# EAGLE board interfacez_main_r2_5 (EAGLE 6.4), part 1 of 2
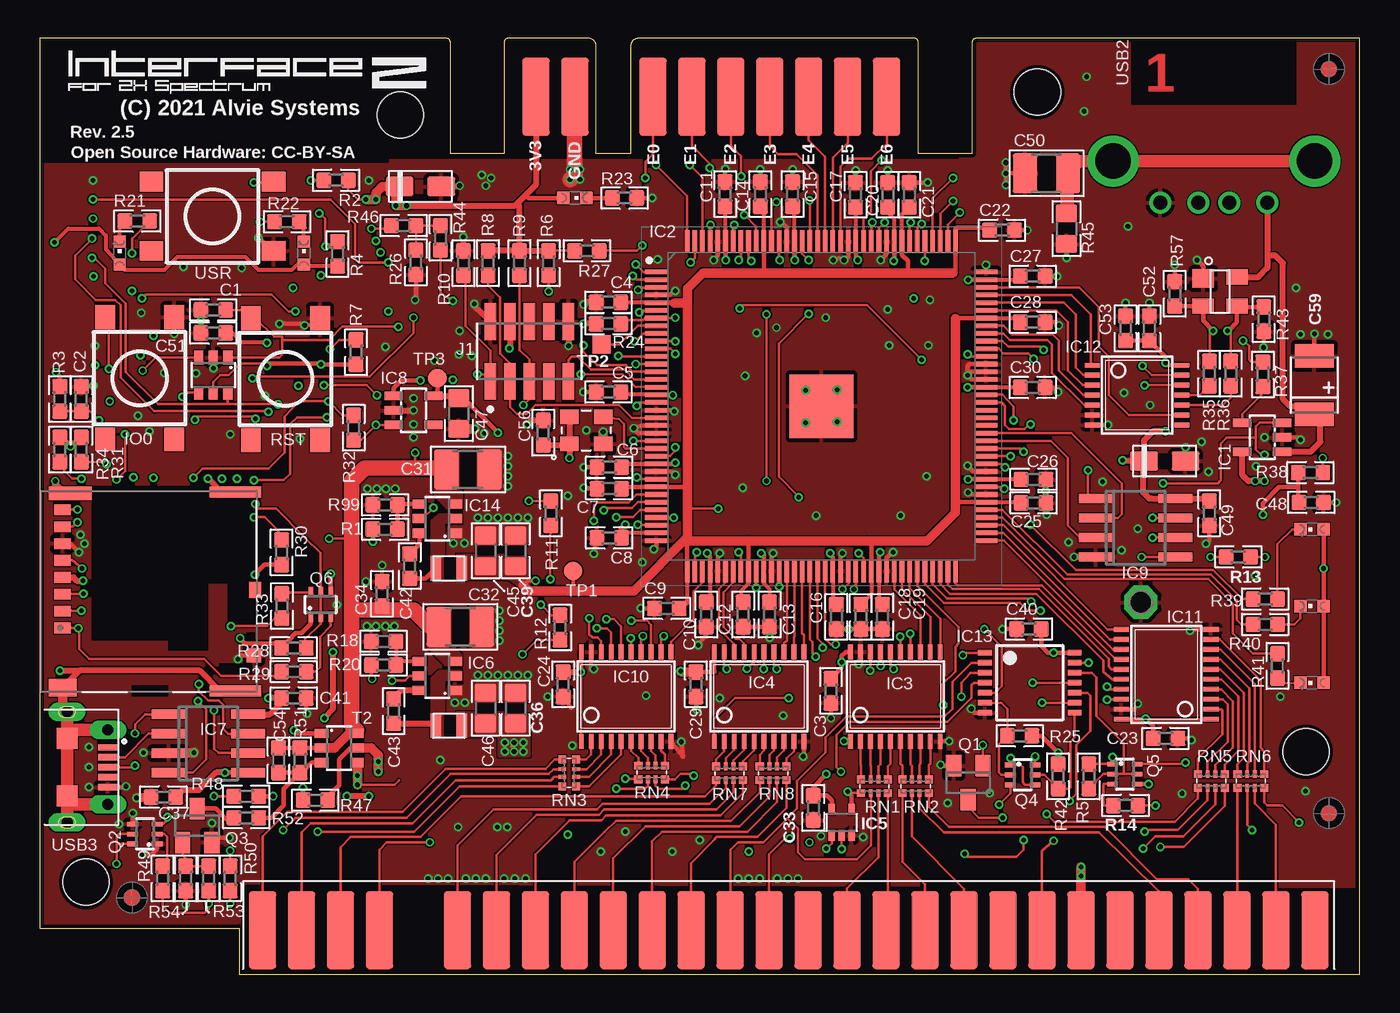
[diagram p5: board, top side]
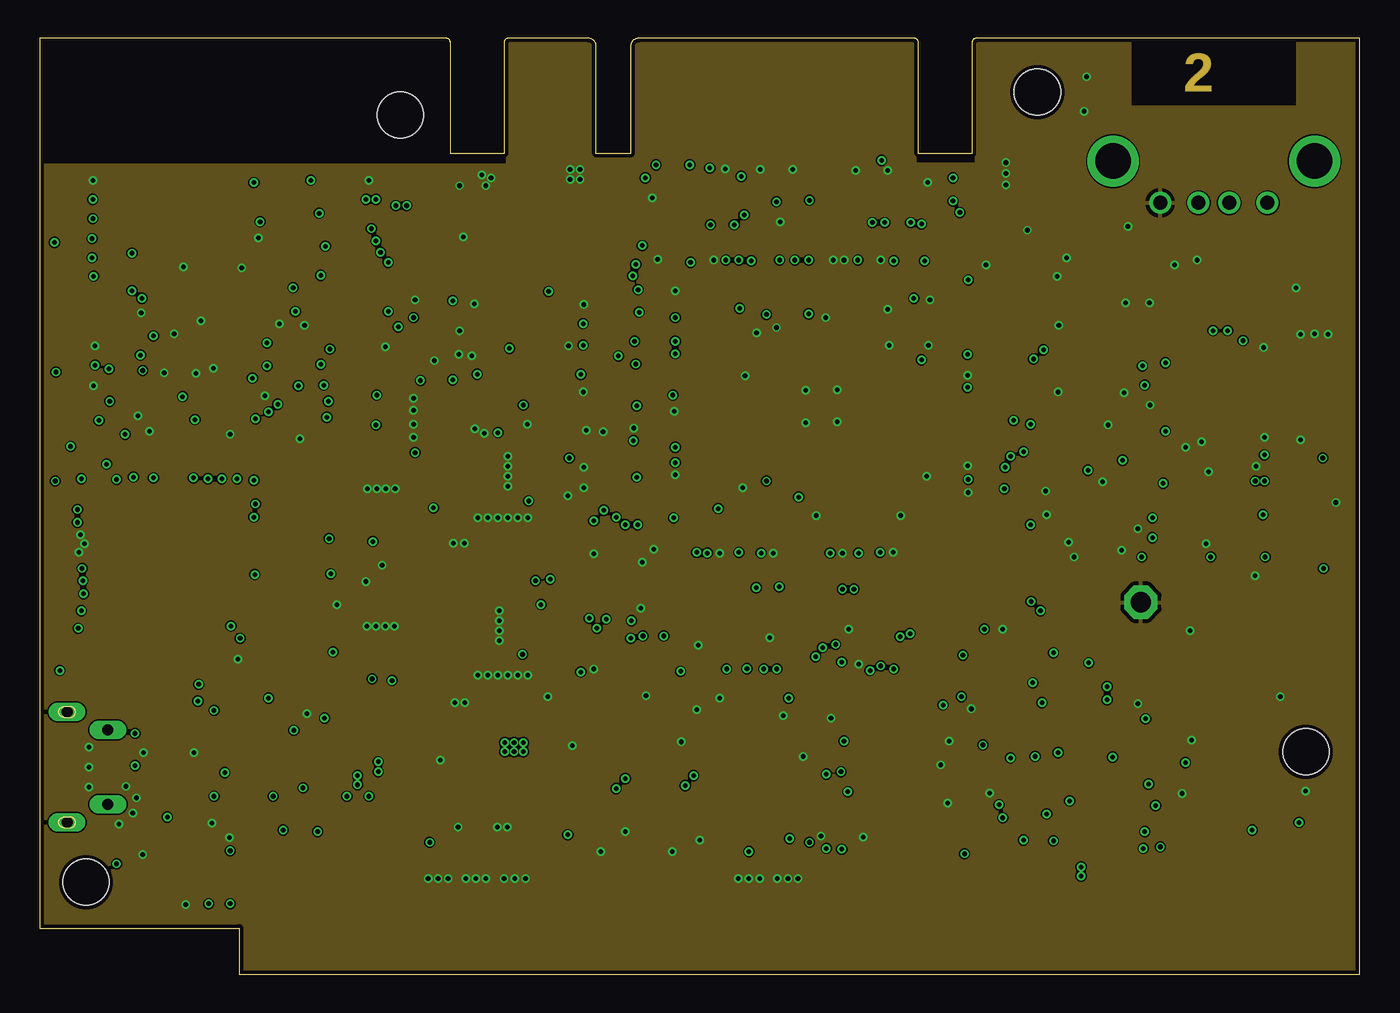
[diagram p6: board, inner layer GND]
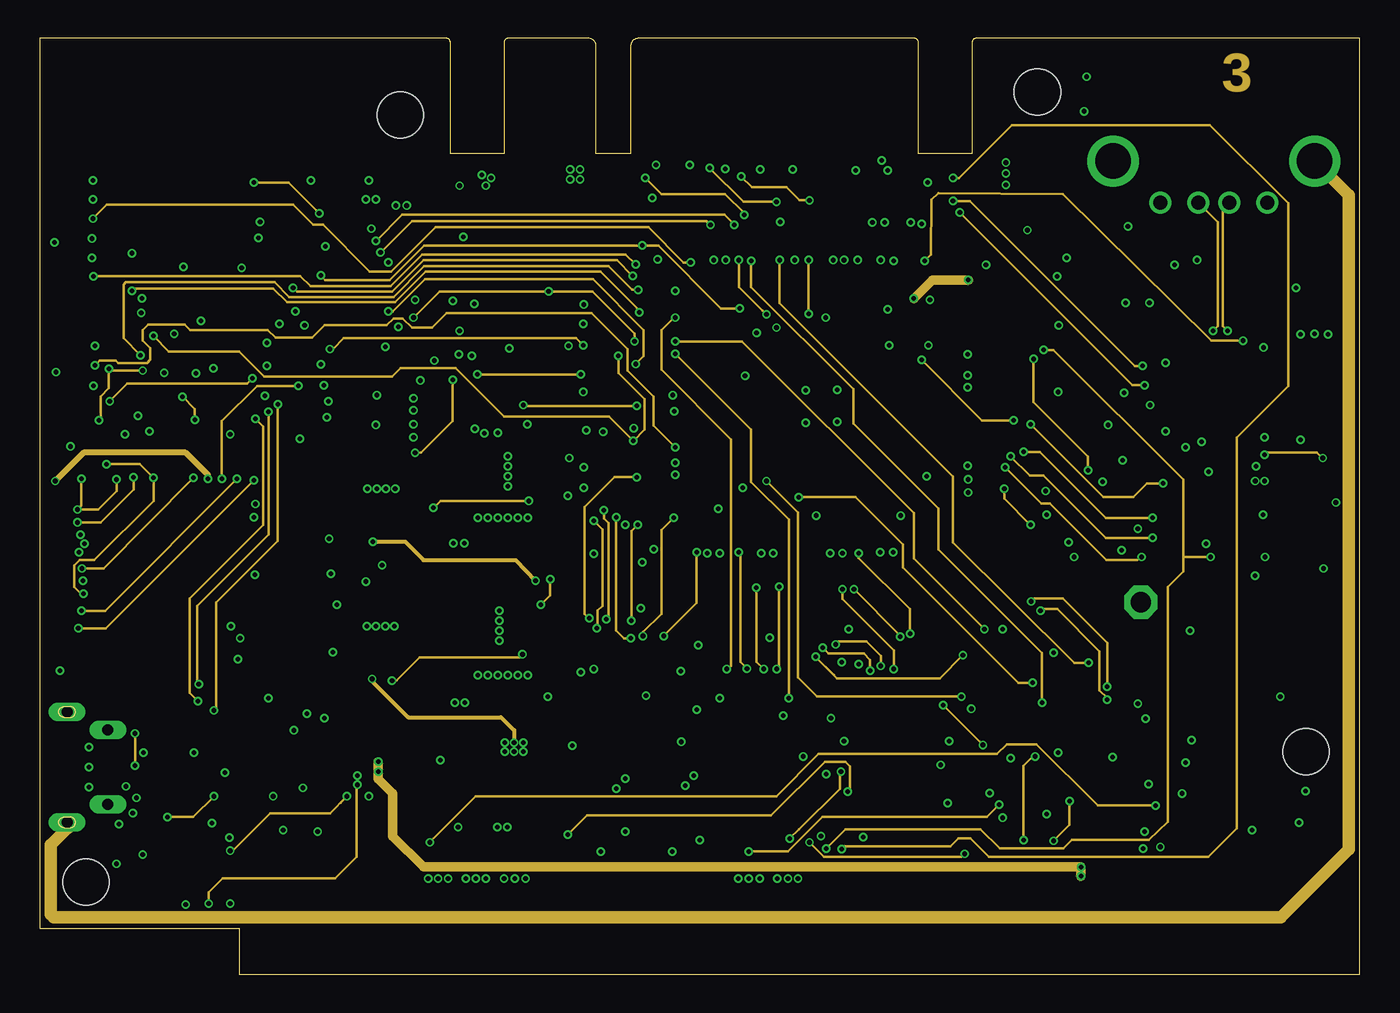
[diagram p7: board, inner layer Route]
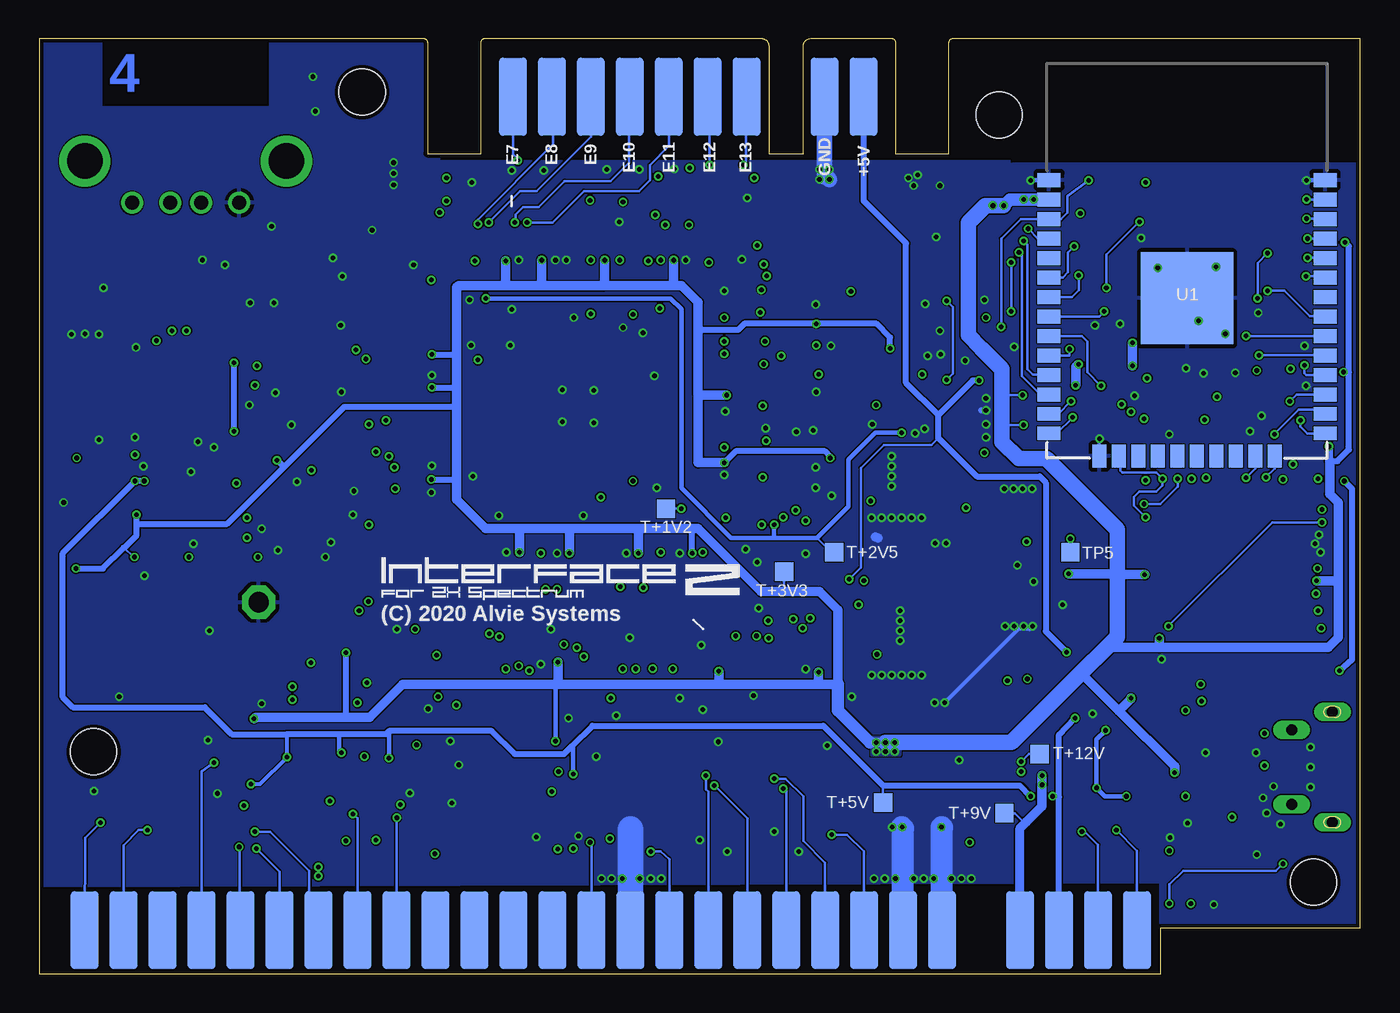
[diagram p8: board, bottom side, seen from below]

Size 86 x 61 mm. Coordinates in mm from the lower left corner, seen from the top.
Outline: 0,61 0,3 13,3 13,0 86,0 86,61 61,61 arc90 60.75,60.75 60.75,53.5 57.25,53.5 57.25,60.75 arc90 57,61 39,61 arc90 38.5,60.5 38.5,53.5 36.25,53.5 36.25,60.5 arc90 35.75,61 30.5,61 arc90 30.25,60.75 30.25,53.5 26.75,53.5 26.75,60.75 arc90 26.5,61 0,61
Copper layers (1*2*15*16): Top 0.035mm / dielectric 0.18mm / GND 0.017mm / dielectric 1.12mm / Route 0.017mm / dielectric 0.18mm / PWR 0.035mm
Design rules "JLCPCB-FourLayerLayer *": minimum track width 3.5mil, minimum drill 0.3mm, track to track 3.5mil, track to pad 5mil, pad to pad 5mil, via to via 5mil, smd to smd 0mil, copper to edge 10mil, drill to drill 10mil, minimum pad ring 10mil, minimum via ring 0.125mm, stop-mask expansion 2mil, vias tented up to drill 100mil, thermal gap 10mil
Holes 3 mm at 3,6 82.5,14.5 23.5,56 65,57.5

## Footprints (pad centres in the part's own frame; a part is rotated, then mirrored left to right if it is on the bottom)
0603 = smd 1 x 1: 1 -0.8,0; 2 0.8,0
1210 = smd 1.6 x 2.6: 1 -1.4,0; 2 1.4,0
0805 = smd 1.2 x 1.4: 1 -1,0; 2 1,0
TANT_CASE_A = smd 1.8 x 1.23: MINUS 1.355,0; PLUS -1.355,0
TE-B-3528 = smd 1.524 x 2.54: + 1.905,0; - -1.905,0
ZX-EDGE-DAUGHTERBOARD = smd 1.778 x 5.08 bottom: A1 6.35,-1.27; A2 3.81,-1.27; A3 1.27,-1.27; A4 -1.27,-1.27; A6 -6.35,-1.27; A7 -8.89,-1.27; A8 -11.43,-1.27; A9 -13.97,-1.27; A10 -16.51,-1.27; A11 -19.05,-1.27; A12 -21.59,-1.27; A13 -24.13,-1.27; A14 -26.67,-1.27; A15 -29.21,-1.27; A16 -31.75,-1.27; A17 -34.29,-1.27; A18 -36.83,-1.27; A19 -39.37,-1.27; A20 -41.91,-1.27; A21 -44.45,-1.27; A22 -46.99,-1.27; A23 -49.53,-1.27; A24 -52.07,-1.27; A25 -54.61,-1.27; A26 -57.15,-1.27; A27 -59.69,-1.27; A28 -62.23,-1.27 | smd 1.778 x 5.08: B1 6.35,-1.27; B2 3.81,-1.27; B3 1.27,-1.27; B4 -1.27,-1.27; B6 -6.35,-1.27; B7 -8.89,-1.27; B8 -11.43,-1.27; B9 -13.97,-1.27; B10 -16.51,-1.27; B11 -19.05,-1.27; B12 -21.59,-1.27; B13 -24.13,-1.27; B14 -26.67,-1.27; B15 -29.21,-1.27; B16 -31.75,-1.27; B17 -34.29,-1.27; B18 -36.83,-1.27; B19 -39.37,-1.27; B20 -41.91,-1.27; B21 -44.45,-1.27; B22 -46.99,-1.27; B23 -49.53,-1.27; B24 -52.07,-1.27; B25 -54.61,-1.27; B26 -57.15,-1.27; B27 -59.69,-1.27; B28 -62.23,-1.27
SOT23-5L = smd 0.55 x 1.2: 1 -0.95,-1.3; 2 0,-1.3; 3 0.95,-1.3; 4 0.95,1.3; 5 -0.95,1.3
QFP50P2200X2200X165-145N = smd 1.475 x 0.3: 1 -10.738,8.75; 2 -10.738,8.25; 3 -10.738,7.75; 4 -10.738,7.25; 5 -10.738,6.75; 6 -10.738,6.25; 7 -10.738,5.75; 8 -10.738,5.25; 9 -10.738,4.75; 10 -10.738,4.25; 11 -10.738,3.75; 12 -10.738,3.25; 13 -10.738,2.75; 14 -10.738,2.25; 15 -10.738,1.75; 16 -10.738,1.25; 17 -10.738,0.75; 18 -10.738,0.25; 19 -10.738,-0.25; 20 -10.738,-0.75; 21 -10.738,-1.25; 22 -10.738,-1.75; 23 -10.738,-2.25; 24 -10.738,-2.75; 25 -10.738,-3.25; 26 -10.738,-3.75; 27 -10.738,-4.25; 28 -10.738,-4.75; 29 -10.738,-5.25; 30 -10.738,-5.75; 31 -10.738,-6.25; 32 -10.738,-6.75; 33 -10.738,-7.25; 34 -10.738,-7.75; 35 -10.738,-8.25; 36 -10.738,-8.75; 73 10.738,-8.75; 74 10.738,-8.25; 75 10.738,-7.75; 76 10.738,-7.25; 77 10.738,-6.75; 78 10.738,-6.25; 79 10.738,-5.75; 80 10.738,-5.25; 81 10.738,-4.75; 82 10.738,-4.25; 83 10.738,-3.75; 84 10.738,-3.25; 85 10.738,-2.75; 86 10.738,-2.25; 87 10.738,-1.75; 88 10.738,-1.25; 89 10.738,-0.75; 90 10.738,-0.25; 91 10.738,0.25; 92 10.738,0.75; 93 10.738,1.25; 94 10.738,1.75; 95 10.738,2.25; 96 10.738,2.75; 97 10.738,3.25; 98 10.738,3.75; 99 10.738,4.25; 100 10.738,4.75; 101 10.738,5.25; 102 10.738,5.75; 103 10.738,6.25; 104 10.738,6.75; 105 10.738,7.25; 106 10.738,7.75; 107 10.738,8.25; 108 10.738,8.75 | smd 0.3 x 1.475: 37 -8.75,-10.738; 38 -8.25,-10.738; 39 -7.75,-10.738; 40 -7.25,-10.738; 41 -6.75,-10.738; 42 -6.25,-10.738; 43 -5.75,-10.738; 44 -5.25,-10.738; 45 -4.75,-10.738; 46 -4.25,-10.738; 47 -3.75,-10.738; 48 -3.25,-10.738; 49 -2.75,-10.738; 50 -2.25,-10.738; 51 -1.75,-10.738; 52 -1.25,-10.738; 53 -0.75,-10.738; 54 -0.25,-10.738; 55 0.25,-10.738; 56 0.75,-10.738; 57 1.25,-10.738; 58 1.75,-10.738; 59 2.25,-10.738; 60 2.75,-10.738; 61 3.25,-10.738; 62 3.75,-10.738; 63 4.25,-10.738; 64 4.75,-10.738; 65 5.25,-10.738; 66 5.75,-10.738; 67 6.25,-10.738; 68 6.75,-10.738; 69 7.25,-10.738; 70 7.75,-10.738; 71 8.25,-10.738; 72 8.75,-10.738; 109 8.75,10.738; 110 8.25,10.738; 111 7.75,10.738; 112 7.25,10.738; 113 6.75,10.738; 114 6.25,10.738; 115 5.75,10.738; 116 5.25,10.738; 117 4.75,10.738; 118 4.25,10.738; 119 3.75,10.738; 120 3.25,10.738; 121 2.75,10.738; 122 2.25,10.738; 123 1.75,10.738; 124 1.25,10.738; 125 0.75,10.738; 126 0.25,10.738; 127 -0.25,10.738; 128 -0.75,10.738; 129 -1.25,10.738; 130 -1.75,10.738; 131 -2.25,10.738; 132 -2.75,10.738; 133 -3.25,10.738; 134 -3.75,10.738; 135 -4.25,10.738; 136 -4.75,10.738; 137 -5.25,10.738; 138 -5.75,10.738; 139 -6.25,10.738; 140 -6.75,10.738; 141 -7.25,10.738; 142 -7.75,10.738; 143 -8.25,10.738; 144 -8.75,10.738 | smd 4.15 x 4.15: 145 0,0
TSSOP20 = smd 0.305 x 0.991: 1 -2.925,-2.918; 2 -2.275,-2.918; 3 -1.625,-2.918; 4 -0.975,-2.918; 5 -0.325,-2.918; 6 0.325,-2.918; 7 0.975,-2.918; 8 1.625,-2.918; 9 2.275,-2.918; 10 2.925,-2.918; 11 2.925,2.918; 12 2.275,2.918; 13 1.625,2.918; 14 0.975,2.918; 15 0.325,2.918; 16 -0.325,2.918; 17 -0.975,2.918; 18 -1.625,2.918; 19 -2.275,2.918; 20 -2.925,2.918
SC70-5 = smd 0.4 x 0.7: 1 -0.65,-0.85; 2 0,-0.85; 3 0.65,-0.85; 4 0.65,0.85; 5 -0.65,0.85
SOT23-6 = smd 0.6 x 0.9: 1 -0.95,-1.15; 2 0,-1.15; 3 0.95,-1.15; 4 0.95,1.15; 5 0,1.15; 6 -0.95,1.15
SOIC8 = smd 0.6 x 2.2: 1 -1.905,-2.6; 2 -0.635,-2.6; 3 0.635,-2.6; 4 1.905,-2.6; 5 1.905,2.6; 6 0.635,2.6; 7 -0.635,2.6; 8 -1.905,2.6
TSSOP14 = smd 0.305 x 0.991: 1 -1.95,-2.918; 2 -1.3,-2.918; 3 -0.65,-2.918; 4 0,-2.918; 5 0.65,-2.918; 6 1.3,-2.918; 7 1.95,-2.918; 8 1.95,2.918; 9 1.3,2.918; 10 0.65,2.918; 11 0,2.918; 12 -0.65,2.918; 13 -1.3,2.918; 14 -1.95,2.918
TSSOP14' = smd 0.35 x 0.9: 1 -1.95,-2.925; 2 -1.3,-2.925; 3 -0.65,-2.925; 4 0,-2.925; 5 0.65,-2.925; 6 1.3,-2.925; 7 1.95,-2.925; 8 1.95,2.925; 9 1.3,2.925; 10 0.65,2.925; 11 0,2.925; 12 -0.65,2.925; 13 -1.3,2.925; 14 -1.95,2.925
AMPHENOL_ICC_-_FCI_20021121-00010C4LF_0 = smd 0.76 x 2.4: 1 -2.54,-1.95; 2 -2.54,1.95; 3 -1.27,-1.95; 4 -1.27,1.95; 5 0,-1.95; 6 0,1.95; 7 1.27,-1.95; 8 1.27,1.95; 9 2.54,-1.95; 10 2.54,1.95
MOLEX_503398-1892 = smd 0.7 x 1.1: 1 -2.38,5.625; 2 -1.28,5.625; 3 -0.18,5.625; 4 0.92,5.625; 5 2.02,5.625; 6 3.12,5.625; 7 4.22,5.625; 8 5.32,5.625 | smd 0.9 x 0.93: 9 -4.17,-6.84 | smd 1.05 x 0.78: 10 0.095,-6.915 | smd 1.14 x 1.83: P1 -6.26,5.61 | smd 0.86 x 2.8: P2 6.4,5.125 | smd 0.7 x 3.33: P3 -6.48,-5.64; P4 6.48,-5.64
IND_0806 = smd 0.7 x 1.6: P$1 -0.85,0; P$2 0.85,0
LED-603 = smd 0.8 x 0.8: A 0,-0.75; C 0,0.75
SOT23 = smd 1 x 1.4: 1 -0.95,-1.1; 2 0.95,-1.1; 3 0,1.1
SOT363_INFINEON = smd 0.3 x 0.7: 1 -0.65,-0.8; 2 0,-0.8; 3 0.65,-0.8; 4 0.65,0.8; 5 0,0.8; 6 -0.65,0.8
EXB28V = smd 0.525 x 0.5: 1 -0.875,-0.45; 4 0.875,-0.45; 5 0.875,0.45; 8 -0.875,0.45 | smd 0.25 x 0.5: 2 -0.25,-0.45; 3 0.25,-0.45; 6 0.25,0.45; 7 -0.25,0.45
TACTILE_SWITCH_TALL = smd 1.55 x 1.3: A1 -3.975,-2.25; A2 3.975,-2.25; B1 -3.975,2.25; B2 3.975,2.25
TP12SQ = smd 1.2 x 1.2: TP 0,0
TP12R = smd 1.2 x 1.2: TP 0,0
P1-13 = drill 1.321 pad 2.159 octagon: TP 0,0
SP0503 = smd 1.2 x 1.4: 1 -0.85,-1.1 | smd 1 x 1.4: 2 0.95,-1.1; 3 0.95,1.1; 4 -0.95,1.1
ESP-WROOM-32 = smd 0.9 x 1.5: 1 7.7,9; 2 6.43,9; 3 5.16,9; 4 3.89,9; 5 2.62,9; 6 1.35,9; 7 0.08,9; 8 -1.19,9; 9 -2.46,9; 10 -3.73,9; 11 -5,9; 12 -6.27,9; 13 -7.54,9; 14 -8.81,9; 25 -8.81,-9; 26 -7.54,-9; 27 -6.27,-9; 28 -5,-9; 29 -3.73,-9; 30 -2.46,-9; 31 -1.19,-9; 32 0.08,-9; 33 1.35,-9; 34 2.62,-9; 35 3.89,-9; 36 5.16,-9; 37 6.43,-9; 38 7.7,-9 | smd 1.5 x 0.9: 15 -10.3,5.715; 16 -10.3,4.445; 17 -10.3,3.175; 18 -10.3,1.905; 19 -10.3,0.635; 20 -10.3,-0.635; 21 -10.3,-1.905; 22 -10.3,-3.175; 23 -10.3,-4.445; 24 -10.3,-5.715 | smd 6 x 6: GND 0,0
KC3225K = smd 1.2 x 0.95: 1 -1.1,-0.875; 2 1.1,-0.875; 3 1.1,0.875; 4 -1.1,0.875
INTERFACEZ_EXPANSION_DAUGHTERCARD = smd 1.778 x 5.08 bottom: A1 11.43,0; A2 8.89,0; A4 3.81,0; A5 1.27,0; A6 -1.27,0; A7 -3.81,0; A8 -6.35,0; A9 -8.89,0; A10 -11.43,0 | smd 1.778 x 5.08: B1 11.43,0; B2 8.89,0; B4 3.81,0; B5 1.27,0; B6 -1.27,0; B7 -3.81,0; B8 -6.35,0; B9 -8.89,0; B10 -11.43,0
USB-A-H = drill 0.914: D+ 2.718,-1.003; D- 2.718,1.003; GND 2.718,-3.493; VBUS 2.718,3.493 | drill 2.311: P$5 0,-6.566; P$6 0,6.566
MICROUSB_SMD_TH_7.5MM_4.85MM = smd 0.4 x 1.25: P1 1.3,-2.815; P2 0.65,-2.815; P3 0,-2.815; P4 -0.65,-2.815; P5 -1.3,-2.815 | smd 1.375 x 1.375: S1 -1.875,-0.175; S2 1.875,-0.175 | drill 0.7 pad 1.05 long: S3 -3.6,-0.175; S4 3.6,-0.175 | drill 0.7 pad 1 long: S5 -2.425,-2.825; S6 2.425,-2.825

## Placement (x,y rotation side)
C1  100nF 6.3V  [0603]  11.3,43.3 0 top
C2  100nF 6.3V  [0603]  2.7,37.5 270 top
C3  100nF 6.3V  [0603]  51.55,18.48 270 top
C4  100nF 6.3V  [0603]  37.05,43.8 180 top
C5  100nF 6.3V  [0603]  37.05,37.95 180 top
C6  100nF 6.3V  [0603]  37.1,33.05 180 top
C7  100nF 6.3V  [0603]  37.1,31.65 180 top
C8  100nF 6.3V  [0603]  37.1,28.45 180 top
C9  100nF 6.3V  [0603]  40.85,23.85 180 top
C10  100nF 6.3V  [0603]  43.42,23.45 270 top
C11  100nF 6.3V  [0603]  44.65,50.85 90 top
C12  100nF 6.3V  [0603]  45.83,23.45 270 top
C13  100nF 6.3V  [0603]  47.55,23.45 270 top
C14  100nF 6.3V  [0603]  46.95,50.85 90 top
C15  100nF 6.3V  [0603]  49.05,50.85 90 top
C16  100nF 6.3V  [0603]  51.9,23.3 270 top
C17  100nF 6.3V  [0603]  53.15,50.8 90 top
C18  100nF 6.3V  [0603]  53.5,23.3 270 top
C19  100nF 6.3V  [0603]  54.9,23.3 270 top
C20  100nF 6.3V  [0603]  55.25,50.8 90 top
C21  100nF 6.3V  [0603]  56.65,50.8 90 top
C22  100nF 6.3V  [0603]  62.7,48.5 0 top
C23  100nF 6.3V  [0603]  73.35,15.38 0 top
C24  100nF 6.3V  [0603]  34.1,18.9 270 top
C25  100nF 6.3V  [0603]  64.75,32.25 0 top
C26  100nF 6.3V  [0603]  64.75,30.73 0 top
C27  100nF 6.3V  [0603]  64.7,45.5 0 top
C28  100nF 6.3V  [0603]  64.7,42.5 0 top
C29  100nF 6.3V  [0603]  42.75,18.9 270 top
C30  100nF 6.3V  [0603]  64.7,38.25 0 top
C31  22uF 16V  [1210]  27.9,32.9 180 top
C32  22uF 16V  [1210]  27.4,22.65 180 top
C33  100nF 6.3V  [0603]  50.4,10.85 90 top
C34  100nF 16V  [0603]  22.3,24.8 270 top
C36  22uF 6.3V  [0805]  31,17.35 270 top
C37  1uF 6.3V  [0603]  8.05,11.55 180 top
C39  22uF 6.3V  [0805]  31,27.6 270 top
C40  100nF 6.3V  [0603]  64.45,22.5 0 top
C41  100nF 6.3V  [0603]  16.55,18 0 top
C42  100nF 6.3V  [0603]  24.1,26.6 90 top
C43  100nF 6.3V  [0603]  23.05,17.15 90 top
C45  22uF 6.3V  [0805]  29.05,27.6 270 top
C46  22uF 6.3V  [0805]  29.05,17.35 270 top
C47  10uF 6.3V  [0805]  27.3,36.55 90 top
C48  100nF 6.3V  [0603]  82.85,30.75 180 top
C49  100nF 6.3V  [0603]  76.2,30.05 90 top
C50  1000pF 2KV  [1210]  65.6,52.2 180 top
C51  100nF 6.3V  [0603]  11.3,41.8 0 top
C52  100nF 6.3V  [0603]  72.3,42.1 90 top
C53  100nF 6.3V  [0603]  70.75,42.1 90 top
C54  100nF 16V  [0603]  15.55,13.95 90 top
C56  100nF 6.3V  [0603]  32.8,35.3 90 top
C57  47uF 6.3V TANT  [TANT_CASE_A]  24.8,51.35 0 top
C59  TAJB107M010RNJ  [TE-B-3528]  83.05,38.4 270 top
C60  47uF 6.3V TANT  [TANT_CASE_A]  73.3,33.45 0 top
CONN1  ZX_EDGE_DAUGHTERBOARD  [ZX-EDGE-DAUGHTERBOARD]  20.86,1.6 180 top
IC1  STMPS2141STR  [SOT23-5L]  79.65,35 90 top
IC2  EP4CE6E22C8N  [QFP50P2200X2200X165-145N]  50.92,37.02 0 top
IC3  74LCX245FT  [TSSOP20]  55.75,18.1 0 top
IC4  74LCX245FT  [TSSOP20]  46.87,18.1 0 top
IC5  74AHC1G125DCK  [SC70-5]  52.25,9.9 0 top
IC6  AP62250UW  [SOT23-6]  25.9,19.45 90 top
IC7  CH330N  [SOIC8]  10.98,15.05 270 top
IC8  MIC5504-2.5YM5-TR  [SOT23-5L]  24.35,36.75 270 top
IC9  LY68L6400SLIT  [SOIC8]  71.4,29.1 270 top
IC10  74LCX245FT  [TSSOP20]  38.2,18.1 0 top
IC11  74LCX245FT  [TSSOP20]  73.4,19.55 90 top
IC12  USB1T11AMTCX  [TSSOP14]  71.5,37.75 270 top
IC13  74LVC06APW,118  [TSSOP14']  64.5,19 270 top
IC14  AP62250UW  [SOT23-6]  25.9,29.7 90 top
J1  AMPHENOL_ICC_-_FCI_20021121-00010C4LFAMPHENOL_ICC_-_FCI_20021121-00010C4LF_0_0  [AMPHENOL_ICC_-_FCI_20021121-00010C4LF_0]  31.9,40.6 0 top
J2  503398-1892  [MOLEX_503398-1892]  7.1,24.95 90 top
L1  VLS201610HBX1R0-M1  [IND_0806]  26.65,26.45 0 top
L2  VLS201610HBX2R2-M1  [IND_0806]  26.65,16.2 0 top
LED1  LG L29K-G2J1-24  [LED-603]  5.2,47 0 top
LED2  LG L29K-G2J1-24  [LED-603]  17.2,47 0 top
LED3  LG L29K-G2J1-24  [LED-603]  34.85,50.6 270 top
LED4  LG L29K-G2J1-24  [LED-603]  82.9,29 90 top
LED5  LG L29K-G2J1-24  [LED-603]  82.9,24 90 top
LED6  LG L29K-G2J1-24  [LED-603]  82.9,19 90 top
Q1  BSS123  [SOT23]  60.5,12.5 180 top
Q2  BSS138DW  [SOT363_INFINEON]  6.85,9.15 90 top
Q3  BSS123  [SOT23]  10.25,9.7 0 top
Q4  BSS84DW  [SOT363_INFINEON]  64.05,13 270 top
Q5  BSS84DW  [SOT363_INFINEON]  70.7,13.05 270 top
Q6  BSS84DW  [SOT363_INFINEON]  18.3,24.1 0 top
R1  4K99 1%  [0603]  22.5,29 180 top
R2  10K  [0603]  19.3,51.75 0 top
R3  10K  [0603]  1.3,37.5 90 top
R4  10K  [0603]  19.4,46.95 270 top
R5  10K  [0603]  68.35,12.9 270 top
R6  10K  [0603]  33.15,46.35 90 top
R7  10K  [0603]  20.6,40.55 270 top
R8  10K  [0603]  29.2,46.35 90 top
R9  10K  [0603]  31.25,46.35 90 top
R10  10K  [0603]  27.6,46.35 90 top
R11  10K 1%  [0603]  33.3,30.05 270 top
R12  10K 1%  [0603]  33.9,22.6 90 top
R13  10K 1%  [0603]  78.1,27.2 180 top
R14  0R  [0603]  70.75,11 180 top
R18  10K 1%  [0603]  22.4,21.7 0 top
R20  31K6 1%  [0603]  22.4,20.15 180 top
R21  2K2  [0603]  6.35,49.1 0 top
R22  2K2  [0603]  16.1,49.05 180 top
R23  2K2  [0603]  38.1,50.6 0 top
R24  47K  [0603]  37.05,42.4 0 top
R25  10K  [0603]  63.85,15.55 180 top
R26  10K 1%  [0603]  24.5,46.4 90 top
R27  10K  [0603]  35.65,47.15 180 top
R28  10K  [0603]  16.55,21.27 0 top
R29  10K  [0603]  16.55,19.73 180 top
R30  10K  [0603]  15.75,27.5 270 top
R31  10K  [0603]  2.7,34.2 90 top
R32  10K  [0603]  20.45,35.62 270 top
R33  10K  [0603]  15.78,24 270 top
R34  10K  [0603]  1.3,34.2 90 top
R35  33R  [0603]  76.2,39.15 90 top
R36  33R  [0603]  77.6,39.15 90 top
R37  33R  [0603]  79.7,39.1 90 top
R38  47K  [0603]  82.8,32.7 180 top
R39  2K2  [0603]  79.85,24.45 180 top
R40  2K2  [0603]  79.85,22.8 180 top
R41  2K2  [0603]  80.65,20.1 90 top
R42  10K  [0603]  66.35,12.9 270 top
R43  15K  [0603]  79.75,42.7 90 top
R44  31K6 1%  [0603]  26.1,48 270 top
R45  1M  [0805]  66.9,48.6 270 top
R46  10K  [0603]  23.7,48.8 0 top
R47  10K 1%  [0603]  17.95,11.35 0 top
R48  4K7 1%  [0603]  13.45,11.6 0 top
R49  33R  [0603]  8,6.25 270 top
R50  10K 1%  [0603]  12.4,6.25 90 top
R51  10K 1%  [0603]  16.95,13.95 90 top
R52  4K7 1%  [0603]  13.45,10.2 0 top
R53  4K7 1%  [0603]  11,6.25 270 top
R54  4K7 1%  [0603]  9.5,6.25 270 top
R57  15K  [0603]  73.95,44.35 270 top
R99  10K 1%  [0603]  22.5,30.6 0 top
RN1  33R  [EXB28V]  54.39,12.26 0 top
RN2  33R  [EXB28V]  57.07,12.26 0 top
RN3  33R  [EXB28V]  34.49,13.12 270 top
RN4  33R  [EXB28V]  39.87,13.15 0 top
RN5  33R  [EXB28V]  76.34,12.6 0 top
RN6  33R  [EXB28V]  78.92,12.6 0 top
RN7  33R  [EXB28V]  44.95,13.11 0 top
RN8  33R  [EXB28V]  47.78,13.11 0 top
S1  SWITCHES_SMD-4  [TACTILE_SWITCH_TALL]  16,38.8 90 top
S2  SWITCHES_SMD-4  [TACTILE_SWITCH_TALL]  6.5,38.85 90 top
S3  SWITCHES_SMD-4  [TACTILE_SWITCH_TALL]  11.25,49.4 0 top
T2  DMP2240UDM  [SOT23-6]  19.5,14.75 270 top
T+1V2  TPTP12SQ  [TP12SQ]  45.2,30.35 0 bottom
T+2V5  TPTP12SQ  [TP12SQ]  34.25,27.5 0 bottom
T+3V3  TPTP12SQ  [TP12SQ]  37.5,26.25 0 bottom
T+5V  TPTP12SQ  [TP12SQ]  31.05,11.2 0 bottom
T+9V  TPTP12SQ  [TP12SQ]  23.15,10.5 0 bottom
T+12V  TPTP12SQ  [TP12SQ]  20.85,14.35 0 bottom
TP1  TPTP12R  [TP12R]  34.75,26.3 0 top
TP2  TPTP12SQ  [TP12SQ]  36.6,41.05 0 top
TP3  TPTP12R  [TP12R]  25.9,38.85 0 top
TP4  TPPAD1-13  [P1-13]  71.75,24.25 0 top
TP5  TPTP12SQ  [TP12SQ]  18.85,27.5 0 bottom
TV26  SP0503BAHT  [SP0503]  76.9,44.5 270 top
U1  ESP-WROOM-32  [ESP-WROOM-32]  11.24,44.06 90 bottom
U$1  KC3225K-32MHz  [KC3225K]  35.6,35.45 0 top
U$3  PMS150C-U06  [SOT23-6]  11.3,39.05 180 top
U$5  INTERFACEZ_EDGEDAUGHTER  [INTERFACEZ_EXPANSION_DAUGHTERCARD]  43.75,57.2 180 top
U$6  [FIDUCIAL_G10]  6,5 0 top
U$8  [FIDUCIAL_G10]  84,59 0 top
U$9  [FIDUCIAL_G10]  84,10.5 0 top
USB2  USB-A-H  [USB-A-H]  76.5,53 270 top
USB3  CONN-MICROUSBP2  [MICROUSB_SMD_TH_7.5MM_4.85MM]  1.6,13.5 90 top